# Altium schematic sheet 1_ESP_batt_shield-Power.SchDoc
size A4; SheetNumber: 2; SheetTotal: 3
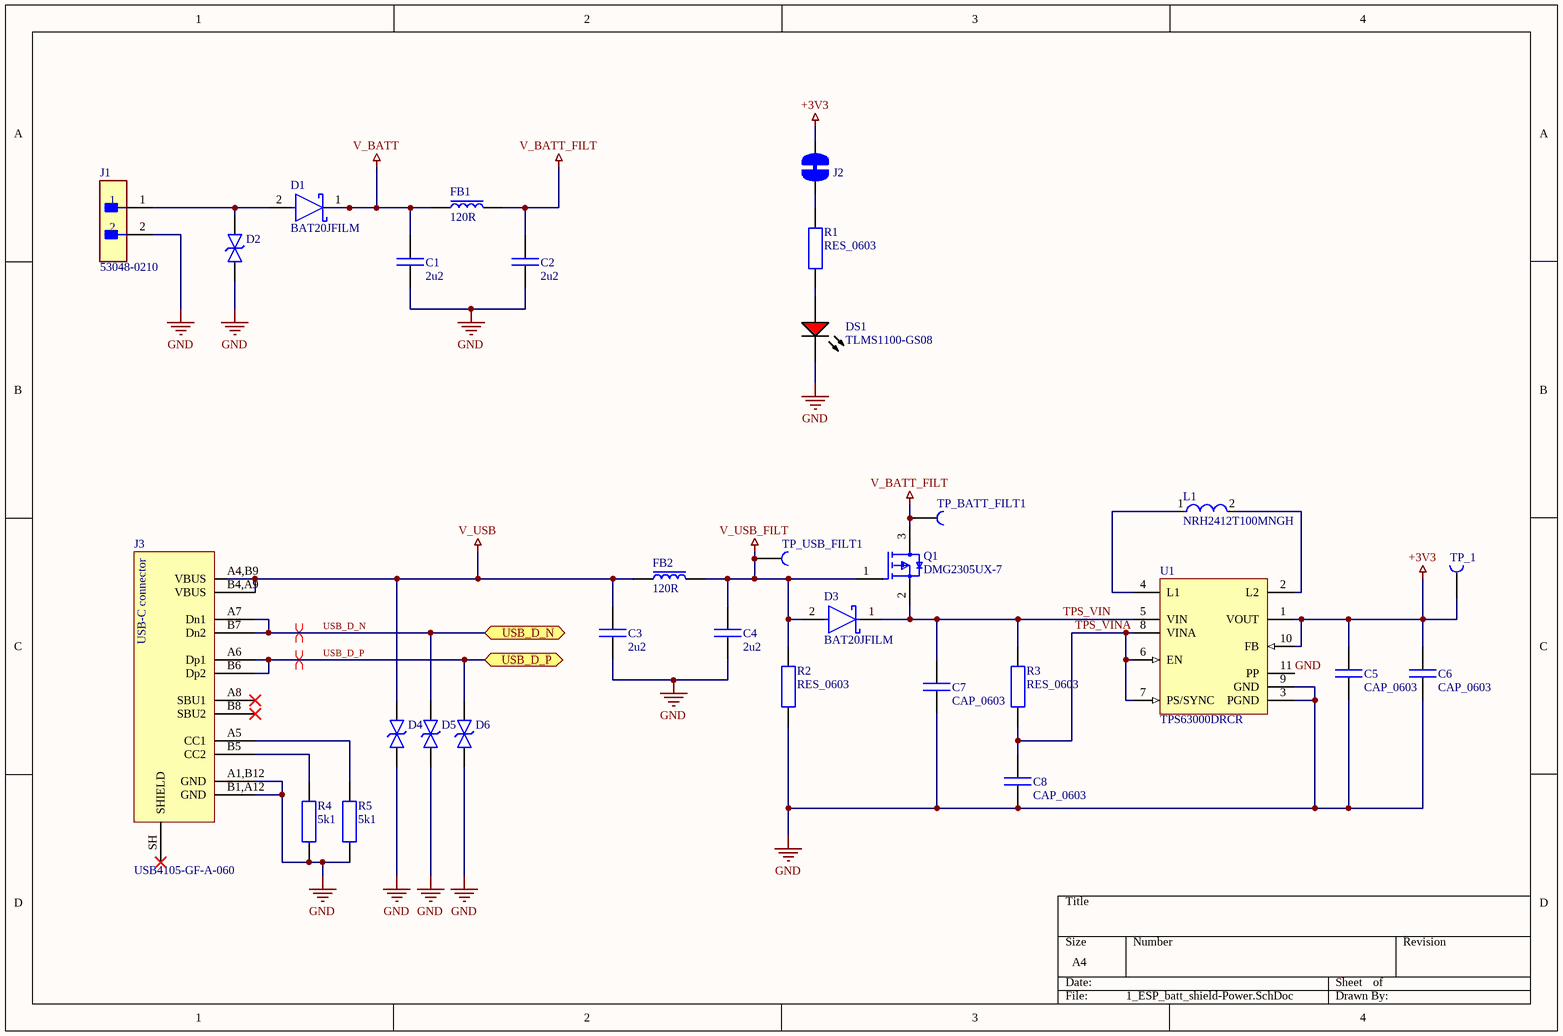
[diagram p0: 1_ESP_batt_shield-Power.SchDoc]

## Parts
C1  2u2  [CAP_0805]
C2  2u2  [CAP_0805]
C3  2u2  [CAP_0805]
C4  2u2  [CAP_0805]
C5  CAP_0603  [CAP_0603]
C6  CAP_0603  [CAP_0603]
C7  CAP_0603  [CAP_0603]
C8  CAP_0603  [CAP_0603]
D1  BAT20JFILM  [FP-BAT20JFILM-MFG]
D2  TWS_LESD5D5.0CT1G  [SOD-523]  (value not drawn)
D3  BAT20JFILM  [FP-BAT20JFILM-MFG]
D4  TWS_LESD5D5.0CT1G  [SOD-523]  (value not drawn)
D5  TWS_LESD5D5.0CT1G  [SOD-523]  (value not drawn)
D6  TWS_LESD5D5.0CT1G  [SOD-523]  (value not drawn)
DS1  TLMS1100-GS08  [VISH-TLMX1100_V]
FB1  120R  [FB_0603]
FB2  120R  [FB_0603]
J1  53048-0210  [FP-53048-0210-MFG]
J2  JUMPER_BRIDGED  [JUMPER_SOLDER_]  (value not drawn)
J3  USB4105-GF-A-060  [GCT_USB4105-GF-A-060]
L1  NRH2412T100MNGH  [FP-NRH2412-MFG]
Q1  DMG2305UX-7  [FP-SOT23-IPC_B]
R1  RES_0603  [RES_0603]
R2  RES_0603  [RES_0603]
R3  RES_0603  [RES_0603]
R4  5k1  [RES_0603]
R5  5k1  [RES_0603]
TP_1  stPoint  [TEST_POINT_ROUND_REC]  (value not drawn)  (no BOM)
TP_BATT_FILT1  TestPoint  [TEST_POINT_ROUND_REC]  (value not drawn)  (no BOM)
TP_USB_FILT1  TestPoint  [TEST_POINT_ROUND_REC]  (value not drawn)  (no BOM)
U1  TPS63000DRCR  [DRC0010J_V]

## Ports
USB_D_N (bidir, see 0_ESP_batt_shield-Overview[2B], 2_ESP_batt_shield-MCU_and_sensors[3C]), USB_D_P (bidir, see 0_ESP_batt_shield-Overview[2B], 2_ESP_batt_shield-MCU_and_sensors[3C])

## Nets
+3V3: C5.2 C6.2 J2.2 TP_1.1 U1.1(VOUT) U1.10(FB)
GND: C1.1 C2.1 C3.1 C4.1 C5.1 C6.1 C7.1 C8.1 D2.1 D4.1 D5.1 D6.1 DS1.2(K) J1.2 J3.A1,B12(GND) J3.B1,A12(GND) R2.1 R4.1 R5.1 U1.3(PGND) U1.9(GND) U1.11(PP)
V_BATT: C1.2 D1.1(K) FB1.1
V_BATT_FILT: C2.2 FB1.2 Q1.3(DRAIN) TP_BATT_FILT1.1
V_USB: C3.2 D4.2 FB2.1 J3.A4,B9(VBUS) J3.B4,A9(VBUS)
V_USB_FILT: C4.2 D3.2(A) FB2.2 Q1.1(GATE) R2.2 TP_USB_FILT1.1
TPS_VIN: C7.2 D3.1(K) Q1.2(SOURCE) R3.2 U1.5(VIN)
TPS_VINA: C8.2 R3.1 U1.6(EN) U1.7(PS/SYNC) U1.8(VINA)
USB_D_N: D5.2 J3.A7(Dn1) J3.B7(Dn2) ; port USB_D_N
USB_D_P: D6.2 J3.A6(Dp1) J3.B6(Dp2) ; port USB_D_P
NetD1_2: D1.2(A) D2.2 J1.1
NetDS1_1: DS1.1(A) R1.1
NetJ2_1: J2.1 R1.2
NetJ3_A5: J3.A5(CC1) R5.2
NetJ3_B5: J3.B5(CC2) R4.2
NetL1_1: L1.1 U1.4(L1)
NetL1_2: L1.2 U1.2(L2)

Not connected (* = marked no-connect by the designer): J3 A8(SBU1)* B8(SBU2)* SH(SHIELD)*

## Layout directives
differential pair: USB_D_N, USB_D_P

## Notes on the sheet
- (in symbol USB4105-GF-A-060) USB-C connector

## Library data of the parts
C1-C4 = CAP_0805
D1 D3 = CMP-12187-000030-1: DIODE SCHOTTKY 23V 1A SOD323; Polarity: Standard; Element Configuration: Single; Capacitance: 30pF; Forward Voltage: 620mV; Max Surge Current: 5A; Peak Reverse Current: 12uA; Packaging: Tape and Reel; Weight: 0.01lb; Output Current: 1A; Lead Free: Lead Free; Forward Current: 1A; Mount: Surface Mount; Max Reverse Voltage (DC): 23V; Average Rectified Current: 1A; Max Operating Temperature: 150°C; Max Forward Surge Current (Ifsm): 5A; REACH SVHC: No SVHC; Current Rating: 1A; Length: 1.8mm; Radiation Hardening: No; Max Reverse Leakage Current: 12uA; Voltage Rating (DC): 23V; Height: 1.03mm; Peak Non-Repetitive Surge Current: 5A; Max Repetitive Reverse Voltage (Vrrm): 23V; Min Operating Temperature: -65°C; Number of Pins: 2; Width: 1.35mm; Package Quantity: 1
DS1 = CMP-1666-00027-1: LED, RED, 2.1 V, -40 to 100 degC, 2-Pin SMD (0603), RoHS, Tape and Reel; Type (Capacitors): C0G; Resistance: 100000000000 Ohm; Capacitance: 12 pF; Voltage Rating: 50 V; Tolerance: 5%; Min Operating Temperature: -55degC; REACH SVHC: No SVHC; ComponentLink2Description: Datasheet; ComponentLink1URL: http://www.vishay.com/; Width: 0.8 mm; Package Quantity: 4000; PackageReference: TLMX1100; ComponentLink2URL: http://www.vishay.com/docs/83173/tlmb1100.pdf; Case/Package: 0603; Case Code (Metric): 1608; Packaging: Tape and Reel; Pins: 2; ComponentLink1Description: Manufacturer URL; Max Operating Temperature: 125degC; Height: 0.8 mm; Length: 1.6 mm; Mount: Surface Mount; PackageDescription: 2-Pin Surface Mount Device, Body 1.6 x 0.8 mm; DatasheetVersion: Rev. 2.7, 03/2016; Case Code (Imperial): 0603; Voltage Rating (DC): 50 V; RoHSCompliant: True; Radiation Hardening: No
FB1 FB2 = BLM18AG121SN1D: Murata BLM18AG121SN1D
J1 = CMP-04776-000546-1: CONN HEADER R/A 2POS 1.25MM; Number of Contacts: 2; Gender: Male; Contact Resistance: 20mR; Current Rating: 1A; Voltage Rating: 125V; Insulation Resistance: 100MR; Glow Wire Compliant: Non-compliant; Flammability Rating: UL94 V-0; Housing Color: Natural; Lead Free: Lead Free; Packaging: Tray; Max Operating Temperature: 85°C; Package Quantity: 5000; Housing Material: Nylon; Radiation Hardening: No; Series: PicoBlade; Termination: Through Hole; RoHS Compliant: Yes; Contact Material: Bronze; Number of Circuits: 2; Number of Rows: 1; Min Operating Temperature: -40°C; Mount: Through Hole; Number of Positions: 2; Pitch: 1.25mm; Voltage Rating (DC): 125V; Color: Natural; Orientation: Right Angle; Contact Plating: Tin
J3 = USB4105-GF-A-060: This is 16pin USB-C connector; pin to pad: A1,B12>A1_B12 A4,B9>A4_B9 B1,A12>B1_A12 B4,A9>B4_A9
L1 = CMP-14484-000582-1: Shielded Wirewound Inductor 10uH 20% 0.51A 0.72Ω SMD; DC Resistance (DCR): 600mR; Current Rating: 450mA; Saturation Current: 810mA; Core Material: Ferrite; Test Frequency: 100kHz; Self Resonant Frequency: 29MHz; Termination: SMD/SMT; Shielding: Shielded; Height - Seated (Max): 0.047inch; Case/Package: Nonstandard; Tolerance: 20%; Height: 1.2mm; Package Quantity: 2500; Mount: Surface Mount; Min Operating Temperature: -25°C; Inductance: 10uH; Width: 0.095inch; Length: 0.095inch; RoHS Compliant: Yes; Max DC Current: 810mA; Packaging: Tape and Reel; Max Operating Temperature: 120°C; Halogen Free: Halogen Free
Q1 = CMP-1693-00002-4: MOSFET P-CH 20V 4.2A SOT23; Turn-On Delay Time: 10.8ns; Turn-Off Delay Time: 79.3ns; Threshold Voltage: -900mV; Rise Time: 13.7ns; Gate to Source Voltage (Vgs): 8V; Rds On Max: 52mR; Element Configuration: Single; Fall Time: 34.7ns; Max Power Dissipation: 1.4W; Drain to Source Resistance: 200mR; Number of Channels: 1; Input Capacitance: 808pF; Lead Free: Lead Free; Number of Pins: 3; Length: 3mm; Continuous Drain Current (ID): 4.2A; Contact Plating: Tin; Mount: Surface Mount; Weight: 0.000282oz; Min Operating Temperature: -55°C; Package Quantity: 3000; Drain to Source Voltage (Vdss): 20V; On-State Resistance: 52MR; Max Operating Temperature: 150°C; Height: 1.1mm; REACH SVHC: No SVHC; Packaging: Tape and Reel; Radiation Hardening: No; Case/Package: SOT-23; Width: 1.4mm
R4 R5 = RES_0603
TP_1 = TestPoint
U1 = CMP-0345-00001-2: Buck-Boost Voltage Converter with 1.8 to 5.5 V Input and 1.2 to 5.5 V Output, -40 to 85 degC, 10-Pin SON (DRC), Green (RoHS & no Sb/Br); Manufacturer: Texas Instruments; Vout(Max)(V): 5.5; Synchronous Rectification: TRUE; SubFamily: Buck-Boost Regulator; Vin(Min)(V): 1.8; Iq(Typ)(mA): 0.04; Iout(Max)(A): 1.2; Regulated Outputs(#): 1; Switching Frequency(Max)(kHz): 1500; ComponentLink1Description: Datasheet; Mounting Technology: Surface Mount; DatasheetVersion: SLVS520B; Eco-Plan: Green (RoHS & no Sb/Br); PackageVersion: revL, Sep-2011; PackageDescription: 10-Pin Plastic Small Outline No-Lead, 3 x 3 x 1 mm Body, 0.5 mm Pitch, Exposed Pad; Vout(Min)(V): 1.2; Vin(Max)(V): 5.5; Topology: Buck-Boost; Dynamic Voltage Scaling: TRUE; ComponentLink1URL: http://www.ti.com/general/docs/lit/getliterature.tsp?genericPartNumber=TPS63000&fileType=pdf; PartNumber: TPS63000DRCR; ComponentLink2URL: http://www.ti.com/litv/pdf/mpds117k; PackageReference: DRC0010J; ComponentLink2Description: Package Specification
D2 D4-D6 = TWS_LESD5D5.0CT1G: ComponentLink1Description: Datasheet:; ComponentLink1URL: https://jlcpcb.com/api/file/downloadByFileSystemAccessId/8588884026236657664